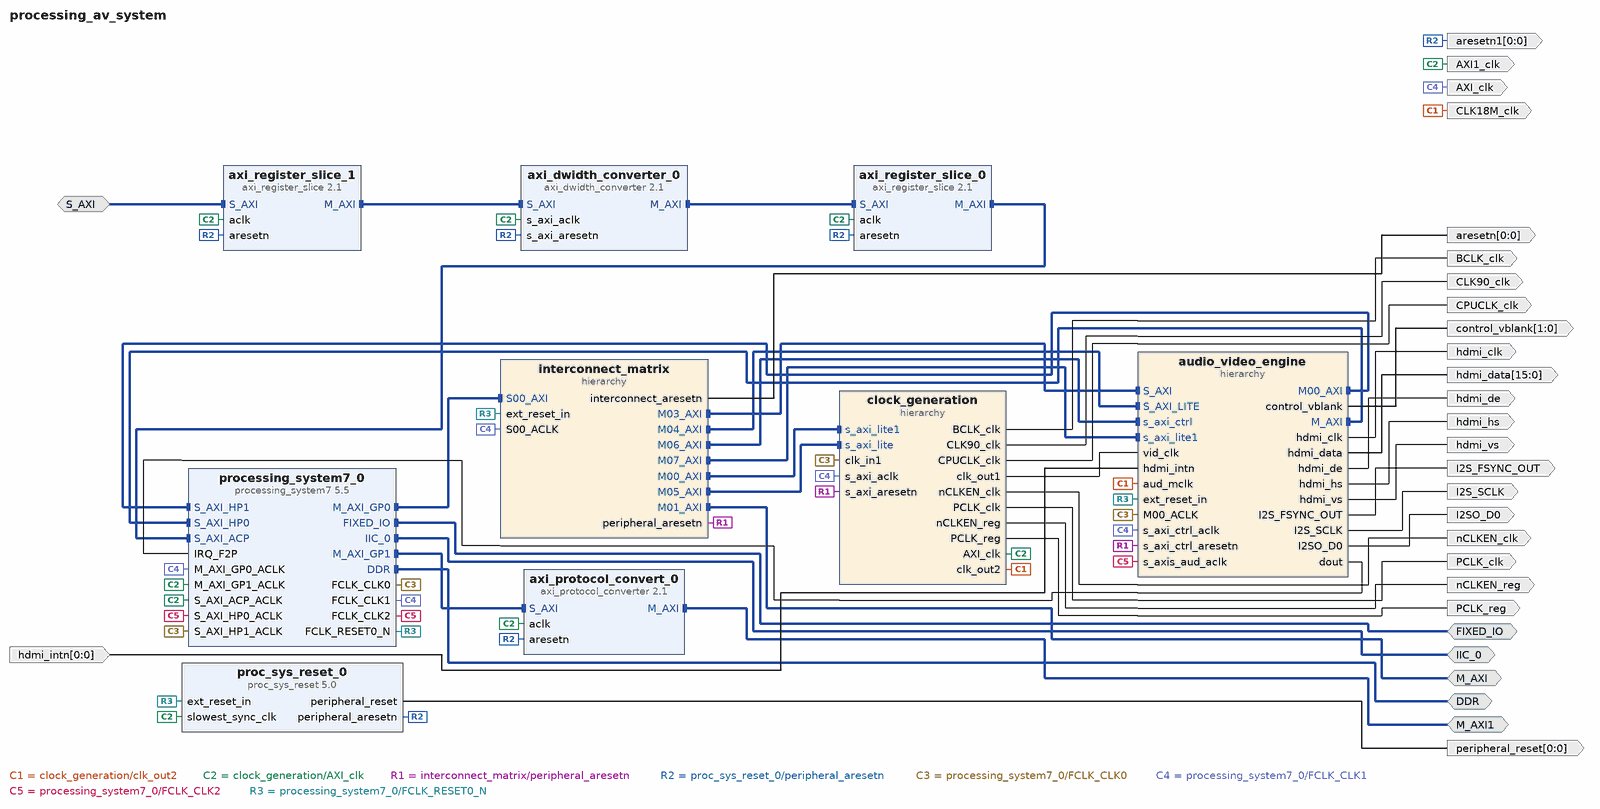
[diagram p0: block diagram of the top level]
# Vivado block design processing_av_system, xc7z020clg400-1, Vivado 2023.2
create_bd_design processing_av_system

create_bd_intf_port -mode Master -vlnv xilinx.com:interface:ddrx_rtl:1.0 DDR
create_bd_intf_port -mode Master -vlnv xilinx.com:display_processing_system7:fixedio_rtl:1.0 FIXED_IO
create_bd_intf_port -mode Master -vlnv xilinx.com:interface:iic_rtl:1.0 IIC_0
create_bd_intf_port -mode Master -vlnv xilinx.com:interface:aximm_rtl:1.0 M_AXI
set_property -dict [list \
  CONFIG.ADDR_WIDTH 31 \
  CONFIG.DATA_WIDTH 32 \
  CONFIG.HAS_BURST 0 \
  CONFIG.HAS_CACHE 0 \
  CONFIG.HAS_LOCK 0 \
  CONFIG.HAS_QOS 0 \
  CONFIG.HAS_REGION 0 \
  CONFIG.PROTOCOL AXI4LITE \
] [get_bd_intf_ports M_AXI]
create_bd_intf_port -mode Master -vlnv xilinx.com:interface:aximm_rtl:1.0 M_AXI1
set_property -dict [list \
  CONFIG.ADDR_WIDTH 32 \
  CONFIG.DATA_WIDTH 32 \
  CONFIG.FREQ_HZ 200000000 \
  CONFIG.HAS_BURST 0 \
  CONFIG.HAS_CACHE 0 \
  CONFIG.HAS_LOCK 0 \
  CONFIG.HAS_QOS 0 \
  CONFIG.HAS_REGION 0 \
  CONFIG.NUM_READ_OUTSTANDING 8 \
  CONFIG.NUM_WRITE_OUTSTANDING 8 \
  CONFIG.PROTOCOL AXI4LITE \
] [get_bd_intf_ports M_AXI1]
create_bd_intf_port -mode Slave -vlnv xilinx.com:interface:aximm_rtl:1.0 S_AXI
set_property -dict [list \
  CONFIG.ADDR_WIDTH 32 \
  CONFIG.ARUSER_WIDTH 5 \
  CONFIG.AWUSER_WIDTH 5 \
  CONFIG.BUSER_WIDTH 0 \
  CONFIG.DATA_WIDTH 32 \
  CONFIG.FREQ_HZ 200000000 \
  CONFIG.HAS_BRESP 1 \
  CONFIG.HAS_BURST 1 \
  CONFIG.HAS_CACHE 1 \
  CONFIG.HAS_LOCK 1 \
  CONFIG.HAS_PROT 1 \
  CONFIG.HAS_QOS 1 \
  CONFIG.HAS_REGION 0 \
  CONFIG.HAS_RRESP 1 \
  CONFIG.HAS_WSTRB 1 \
  CONFIG.ID_WIDTH 0 \
  CONFIG.MAX_BURST_LENGTH 16 \
  CONFIG.NUM_READ_OUTSTANDING 2 \
  CONFIG.NUM_READ_THREADS 1 \
  CONFIG.NUM_WRITE_OUTSTANDING 2 \
  CONFIG.NUM_WRITE_THREADS 1 \
  CONFIG.PROTOCOL AXI3 \
  CONFIG.READ_WRITE_MODE READ_WRITE \
  CONFIG.RUSER_BITS_PER_BYTE 0 \
  CONFIG.RUSER_WIDTH 0 \
  CONFIG.SUPPORTS_NARROW_BURST 1 \
  CONFIG.WUSER_BITS_PER_BYTE 0 \
  CONFIG.WUSER_WIDTH 0 \
] [get_bd_intf_ports S_AXI]
create_bd_port -dir O AXI1_clk
create_bd_port -dir O -type clk AXI_clk
create_bd_port -dir O -type clk BCLK_clk
set_property -dict {CONFIG.FREQ_HZ 25000000} [get_bd_ports BCLK_clk]
create_bd_port -dir O CLK18M_clk
create_bd_port -dir O -type clk CLK90_clk
set_property -dict {CONFIG.FREQ_HZ 25000000} [get_bd_ports CLK90_clk]
create_bd_port -dir O -type clk CPUCLK_clk
set_property -dict {CONFIG.FREQ_HZ 25000000} [get_bd_ports CPUCLK_clk]
create_bd_port -dir O I2SO_D0
create_bd_port -dir O I2S_FSYNC_OUT
create_bd_port -dir O I2S_SCLK
create_bd_port -dir O -type clk PCLK_clk
create_bd_port -dir O PCLK_reg
create_bd_port -dir O -from 0 -to 0 aresetn
create_bd_port -dir O -from 0 -to 0 aresetn1
create_bd_port -dir O -from 1 -to 0 control_vblank
create_bd_port -dir O -type clk hdmi_clk
set_property -dict {CONFIG.FREQ_HZ 148500000} [get_bd_ports hdmi_clk]
create_bd_port -dir O -from 15 -to 0 hdmi_data
create_bd_port -dir O hdmi_de
create_bd_port -dir O hdmi_hs
create_bd_port -dir I -from 0 -to 0 hdmi_intn
create_bd_port -dir O hdmi_vs
create_bd_port -dir O -type clk nCLKEN_clk
set_property -dict {CONFIG.FREQ_HZ 50000000} [get_bd_ports nCLKEN_clk]
create_bd_port -dir O nCLKEN_reg
create_bd_port -dir O -from 0 -to 0 -type rst peripheral_reset
set_property -dict {CONFIG.POLARITY ACTIVE_HIGH} [get_bd_ports peripheral_reset]

create_bd_cell -type hier audio_video_engine
create_bd_cell -type ip -vlnv xilinx.com:ip:axi_dwidth_converter:2.1 axi_dwidth_converter_0
create_bd_cell -type ip -vlnv xilinx.com:ip:axi_protocol_converter:2.1 axi_protocol_convert_0
create_bd_cell -type ip -vlnv xilinx.com:ip:axi_register_slice:2.1 axi_register_slice_0
create_bd_cell -type ip -vlnv xilinx.com:ip:axi_register_slice:2.1 axi_register_slice_1
create_bd_cell -type hier clock_generation
create_bd_cell -type hier interconnect_matrix
create_bd_cell -type ip -vlnv xilinx.com:ip:proc_sys_reset:5.0 proc_sys_reset_0
create_bd_cell -type ip -vlnv xilinx.com:ip:processing_system7:5.5 processing_system7_0
set_property -dict [list \
  CONFIG.PCW_APU_PERIPHERAL_FREQMHZ 666.666666 \
  CONFIG.PCW_ENET0_ENET0_IO {MIO 16 .. 27} \
  CONFIG.PCW_ENET0_GRP_MDIO_ENABLE 1 \
  CONFIG.PCW_ENET0_GRP_MDIO_IO {MIO 52 .. 53} \
  CONFIG.PCW_ENET0_PERIPHERAL_ENABLE 1 \
  CONFIG.PCW_ENET0_RESET_ENABLE 0 \
  CONFIG.PCW_ENET_RESET_ENABLE 1 \
  CONFIG.PCW_ENET_RESET_SELECT {Share reset pin} \
  CONFIG.PCW_EN_CLK1_PORT 1 \
  CONFIG.PCW_EN_CLK2_PORT 1 \
  CONFIG.PCW_EN_RST2_PORT 1 \
  CONFIG.PCW_FCLK_CLK1_BUF TRUE \
  CONFIG.PCW_FPGA0_PERIPHERAL_FREQMHZ 200 \
  CONFIG.PCW_FPGA1_PERIPHERAL_FREQMHZ 100 \
  CONFIG.PCW_FPGA2_PERIPHERAL_FREQMHZ 100 \
  CONFIG.PCW_FPGA_FCLK1_ENABLE 1 \
  CONFIG.PCW_FPGA_FCLK2_ENABLE 1 \
  CONFIG.PCW_GPIO_MIO_GPIO_ENABLE 1 \
  CONFIG.PCW_GPIO_MIO_GPIO_IO MIO \
  CONFIG.PCW_I2C0_I2C0_IO EMIO \
  CONFIG.PCW_I2C0_PERIPHERAL_ENABLE 1 \
  CONFIG.PCW_I2C_PERIPHERAL_FREQMHZ 111.111115 \
  CONFIG.PCW_I2C_RESET_ENABLE 1 \
  CONFIG.PCW_I2C_RESET_SELECT {Share reset pin} \
  CONFIG.PCW_IRQ_F2P_INTR 1 \
  CONFIG.PCW_PERIPHERAL_BOARD_PRESET None \
  CONFIG.PCW_PRESET_BANK1_VOLTAGE {LVCMOS 1.8V} \
  CONFIG.PCW_QSPI_PERIPHERAL_ENABLE 0 \
  CONFIG.PCW_SD0_GRP_CD_ENABLE 1 \
  CONFIG.PCW_SD0_GRP_CD_IO {MIO 46} \
  CONFIG.PCW_SD0_GRP_WP_ENABLE 1 \
  CONFIG.PCW_SD0_GRP_WP_IO {MIO 47} \
  CONFIG.PCW_SD0_PERIPHERAL_ENABLE 1 \
  CONFIG.PCW_SD0_SD0_IO {MIO 40 .. 45} \
  CONFIG.PCW_SDIO_PERIPHERAL_FREQMHZ 50 \
  CONFIG.PCW_S_AXI_HP0_DATA_WIDTH 32 \
  CONFIG.PCW_S_AXI_HP1_DATA_WIDTH 32 \
  CONFIG.PCW_TTC0_PERIPHERAL_ENABLE 1 \
  CONFIG.PCW_TTC0_TTC0_IO EMIO \
  CONFIG.PCW_UART1_PERIPHERAL_ENABLE 1 \
  CONFIG.PCW_UART1_UART1_IO {MIO 48 .. 49} \
  CONFIG.PCW_UART_PERIPHERAL_FREQMHZ 100 \
  CONFIG.PCW_UIPARAM_DDR_FREQ_MHZ 533.333333 \
  CONFIG.PCW_UIPARAM_DDR_PARTNO {MT41J256M16 RE-125} \
  CONFIG.PCW_USB0_PERIPHERAL_ENABLE 1 \
  CONFIG.PCW_USB0_RESET_ENABLE 1 \
  CONFIG.PCW_USB0_RESET_IO {MIO 51} \
  CONFIG.PCW_USB0_USB0_IO {MIO 28 .. 39} \
  CONFIG.PCW_USB_RESET_ENABLE 1 \
  CONFIG.PCW_USB_RESET_SELECT {Share reset pin} \
  CONFIG.PCW_USE_DEFAULT_ACP_USER_VAL 1 \
  CONFIG.PCW_USE_FABRIC_INTERRUPT 1 \
  CONFIG.PCW_USE_M_AXI_GP1 1 \
  CONFIG.PCW_USE_S_AXI_ACP 1 \
  CONFIG.PCW_USE_S_AXI_HP0 1 \
  CONFIG.PCW_USE_S_AXI_HP1 1 \
] [get_bd_cells processing_system7_0]
# 514 more settings of processing_system7_0 are not shown: defaults, MIO pin electricals, DDR timing, and values the tool derives

# ---- hierarchy /audio_video_engine ----
current_bd_instance /audio_video_engine
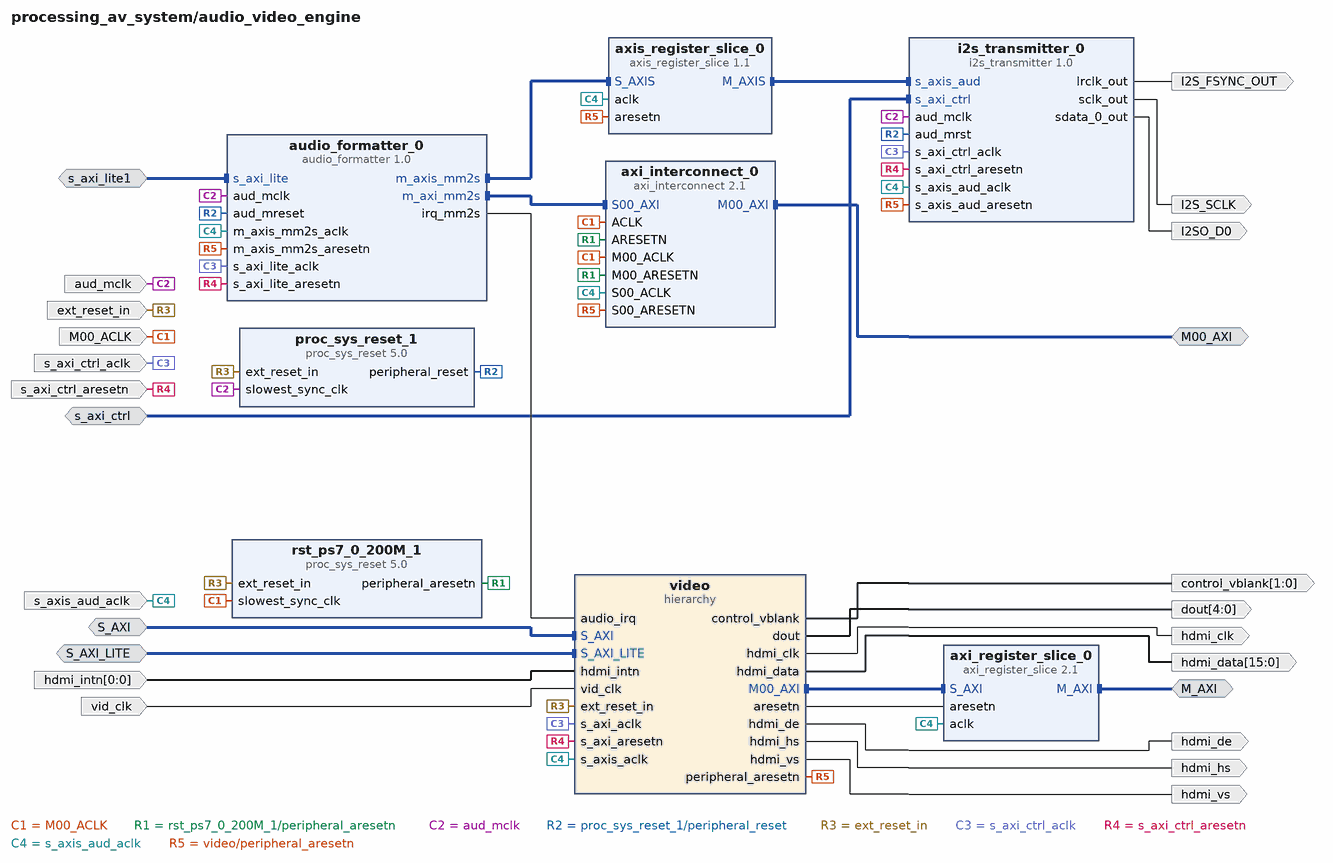
[diagram p1: block diagram inside /audio_video_engine]
create_bd_intf_pin -mode Slave -vlnv xilinx.com:interface:aximm_rtl:1.0 s_axi_ctrl
create_bd_intf_pin -mode Slave -vlnv xilinx.com:interface:aximm_rtl:1.0 s_axi_lite1
create_bd_intf_pin -mode Master -vlnv xilinx.com:interface:aximm_rtl:1.0 M_AXI
create_bd_intf_pin -mode Slave -vlnv xilinx.com:interface:aximm_rtl:1.0 S_AXI_LITE
create_bd_intf_pin -mode Slave -vlnv xilinx.com:interface:aximm_rtl:1.0 S_AXI
create_bd_intf_pin -mode Master -vlnv xilinx.com:interface:aximm_rtl:1.0 M00_AXI
create_bd_pin -dir I -type clk s_axis_aud_aclk
create_bd_pin -dir I -type clk s_axi_ctrl_aclk
create_bd_pin -dir I -type clk aud_mclk
create_bd_pin -dir I -type rst s_axi_ctrl_aresetn
create_bd_pin -dir O I2S_FSYNC_OUT
create_bd_pin -dir O I2SO_D0
create_bd_pin -dir O I2S_SCLK
create_bd_pin -dir I -type rst ext_reset_in
create_bd_pin -dir O -from 1 -to 0 control_vblank
create_bd_pin -dir O -from 4 -to 0 dout
create_bd_pin -dir I -from 0 -to 0 hdmi_intn
create_bd_pin -dir I -type clk vid_clk
create_bd_pin -dir O -type clk hdmi_clk
create_bd_pin -dir O hdmi_vs
create_bd_pin -dir O hdmi_hs
create_bd_pin -dir O -from 15 -to 0 hdmi_data
create_bd_pin -dir O hdmi_de
create_bd_pin -dir I -type clk M00_ACLK

create_bd_cell -type ip -vlnv xilinx.com:ip:proc_sys_reset:5.0 proc_sys_reset_1
create_bd_cell -type hier video
create_bd_cell -type ip -vlnv xilinx.com:ip:proc_sys_reset:5.0 rst_ps7_0_200M_1
create_bd_cell -type ip -vlnv xilinx.com:ip:audio_formatter:1.0 audio_formatter_0
set_property -dict [list \
  CONFIG.C_INCLUDE_S2MM 0 \
  CONFIG.C_MM2S_ADDR_WIDTH 32 \
  CONFIG.C_MM2S_ASYNC_CLOCK 1 \
  CONFIG.C_MM2S_DATAFORMAT 3 \
] [get_bd_cells audio_formatter_0]
create_bd_cell -type ip -vlnv xilinx.com:ip:axi_register_slice:2.1 axi_register_slice_0
create_bd_cell -type ip -vlnv xilinx.com:ip:axis_register_slice:1.1 axis_register_slice_0
create_bd_cell -type ip -vlnv xilinx.com:ip:i2s_transmitter:1.0 i2s_transmitter_0
set_property -dict {CONFIG.C_DWIDTH 16} [get_bd_cells i2s_transmitter_0]
create_bd_cell -type ip -vlnv xilinx.com:ip:axi_interconnect:2.1 axi_interconnect_0
set_property -dict {CONFIG.NUM_MI 1 CONFIG.S00_HAS_REGSLICE 4} [get_bd_cells axi_interconnect_0]

# ---- hierarchy /audio_video_engine/video ----
current_bd_instance /audio_video_engine/video
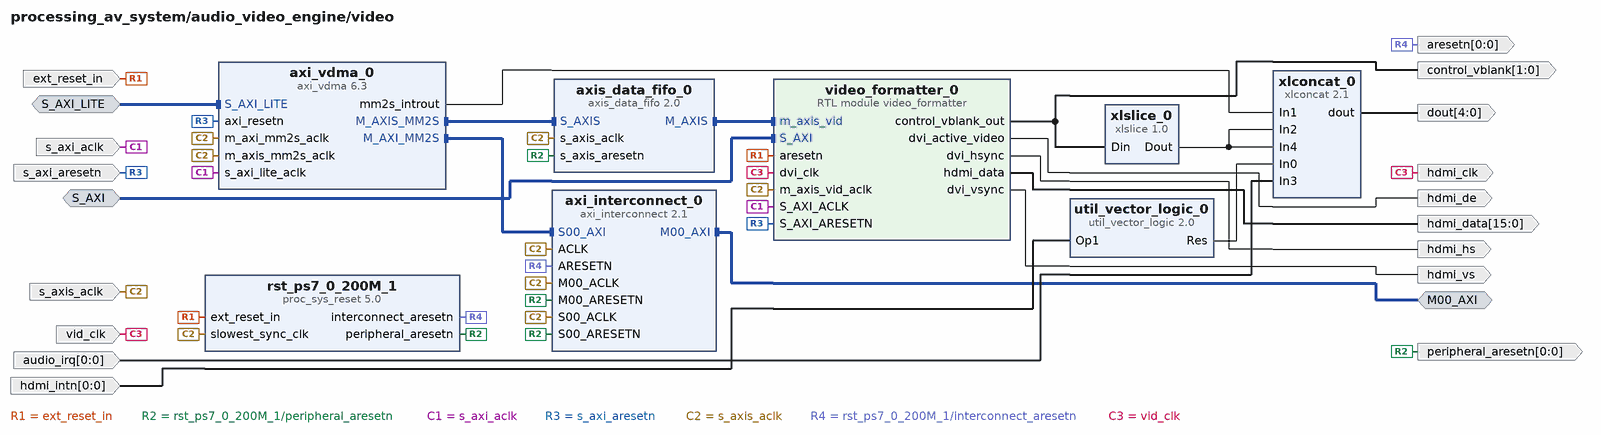
[diagram p2: block diagram inside /audio_video_engine/video]
create_bd_intf_pin -mode Slave -vlnv xilinx.com:interface:aximm_rtl:1.0 S_AXI
create_bd_intf_pin -mode Slave -vlnv xilinx.com:interface:aximm_rtl:1.0 S_AXI_LITE
create_bd_intf_pin -mode Master -vlnv xilinx.com:interface:aximm_rtl:1.0 M00_AXI
create_bd_pin -dir O hdmi_de
create_bd_pin -dir O -from 15 -to 0 hdmi_data
create_bd_pin -dir O hdmi_hs
create_bd_pin -dir O hdmi_vs
create_bd_pin -dir O -type clk hdmi_clk
create_bd_pin -dir I -type clk vid_clk
create_bd_pin -dir I -type clk s_axi_aclk
create_bd_pin -dir I -type rst s_axi_aresetn
create_bd_pin -dir I -type clk s_axis_aclk
create_bd_pin -dir I -from 0 -to 0 hdmi_intn
create_bd_pin -dir O -from 4 -to 0 dout
create_bd_pin -dir I -type rst ext_reset_in
create_bd_pin -dir O -from 1 -to 0 control_vblank
create_bd_pin -dir O -from 0 -to 0 aresetn
create_bd_pin -dir O -from 0 -to 0 -type rst peripheral_aresetn
create_bd_pin -dir I -from 0 -to 0 audio_irq

create_bd_cell -type ip -vlnv xilinx.com:ip:proc_sys_reset:5.0 rst_ps7_0_200M_1
create_bd_cell -type ip -vlnv xilinx.com:ip:axi_vdma:6.3 axi_vdma_0
set_property -dict [list \
  CONFIG.c_include_mm2s_dre 1 \
  CONFIG.c_include_s2mm 0 \
  CONFIG.c_m_axi_mm2s_data_width 32 \
  CONFIG.c_mm2s_genlock_mode 0 \
  CONFIG.c_mm2s_linebuffer_depth 512 \
  CONFIG.c_mm2s_max_burst_length 128 \
  CONFIG.c_num_fstores 1 \
] [get_bd_cells axi_vdma_0]
create_bd_cell -type ip -vlnv xilinx.com:ip:axis_data_fifo:2.0 axis_data_fifo_0
set_property -dict {CONFIG.FIFO_DEPTH 32} [get_bd_cells axis_data_fifo_0]
create_bd_cell -type ip -vlnv xilinx.com:ip:util_vector_logic:2.0 util_vector_logic_0
set_property -dict {CONFIG.C_OPERATION not CONFIG.C_SIZE 1} [get_bd_cells util_vector_logic_0]
create_bd_cell -type ip -vlnv xilinx.com:ip:xlconcat:2.1 xlconcat_0
set_property -dict {CONFIG.NUM_PORTS 5 CONFIG.dout_width 5} [get_bd_cells xlconcat_0]
create_bd_cell -type ip -vlnv xilinx.com:ip:xlslice:1.0 xlslice_0
set_property -dict {CONFIG.DIN_FROM 1 CONFIG.DIN_TO 1 CONFIG.DIN_WIDTH 2 CONFIG.DOUT_WIDTH 1} [get_bd_cells xlslice_0]
create_bd_cell -type module -reference video_formatter video_formatter_0
create_bd_cell -type ip -vlnv xilinx.com:ip:axi_interconnect:2.1 axi_interconnect_0
set_property -dict {CONFIG.NUM_MI 1 CONFIG.S00_HAS_REGSLICE 4} [get_bd_cells axi_interconnect_0]

# ---- hierarchy /clock_generation ----
current_bd_instance /clock_generation
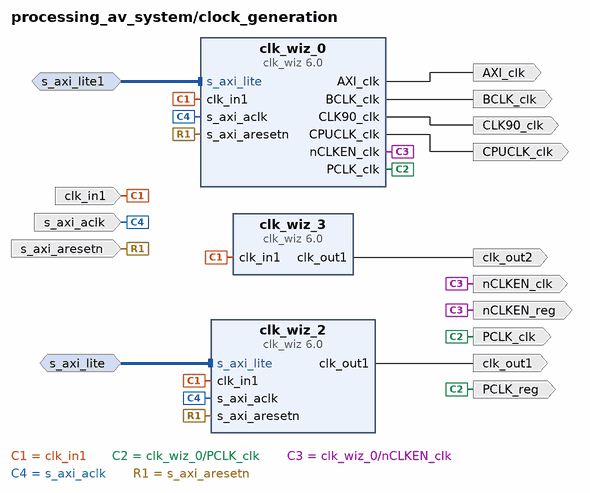
[diagram p3: block diagram inside /clock_generation]
create_bd_intf_pin -mode Slave -vlnv xilinx.com:interface:aximm_rtl:1.0 s_axi_lite
create_bd_intf_pin -mode Slave -vlnv xilinx.com:interface:aximm_rtl:1.0 s_axi_lite1
create_bd_pin -dir I -type clk clk_in1
create_bd_pin -dir I -type clk s_axi_aclk
create_bd_pin -dir I -type rst s_axi_aresetn
create_bd_pin -dir O -type clk clk_out1
create_bd_pin -dir O -type clk AXI_clk
create_bd_pin -dir O -type clk nCLKEN_clk
create_bd_pin -dir O -type clk PCLK_clk
create_bd_pin -dir O -type clk CPUCLK_clk
create_bd_pin -dir O -type clk CLK90_clk
create_bd_pin -dir O -type clk BCLK_clk
create_bd_pin -dir O -type clk clk_out2
create_bd_pin -dir O PCLK_reg
create_bd_pin -dir O nCLKEN_reg

create_bd_cell -type ip -vlnv xilinx.com:ip:clk_wiz:6.0 clk_wiz_0
set_property -dict [list \
  CONFIG.CLKIN1_JITTER_PS 50.0 \
  CONFIG.CLKOUT1_DRIVES BUFGCE \
  CONFIG.CLKOUT1_JITTER 96.634 \
  CONFIG.CLKOUT1_MATCHED_ROUTING true \
  CONFIG.CLKOUT1_PHASE_ERROR 91.235 \
  CONFIG.CLKOUT1_REQUESTED_OUT_FREQ 200 \
  CONFIG.CLKOUT2_DRIVES BUFGCE \
  CONFIG.CLKOUT2_JITTER 110.629 \
  CONFIG.CLKOUT2_MATCHED_ROUTING true \
  CONFIG.CLKOUT2_PHASE_ERROR 91.235 \
  CONFIG.CLKOUT2_REQUESTED_OUT_FREQ 100 \
  CONFIG.CLKOUT2_REQUESTED_PHASE 30.000 \
  CONFIG.CLKOUT2_USED true \
  CONFIG.CLKOUT3_DRIVES BUFGCE \
  CONFIG.CLKOUT3_JITTER 127.364 \
  CONFIG.CLKOUT3_MATCHED_ROUTING true \
  CONFIG.CLKOUT3_PHASE_ERROR 91.235 \
  CONFIG.CLKOUT3_REQUESTED_DUTY_CYCLE 50.000 \
  CONFIG.CLKOUT3_REQUESTED_OUT_FREQ 50 \
  CONFIG.CLKOUT3_REQUESTED_PHASE 60.000 \
  CONFIG.CLKOUT3_USED true \
  CONFIG.CLKOUT4_DRIVES BUFGCE \
  CONFIG.CLKOUT4_JITTER 146.624 \
  CONFIG.CLKOUT4_MATCHED_ROUTING true \
  CONFIG.CLKOUT4_PHASE_ERROR 91.235 \
  CONFIG.CLKOUT4_REQUESTED_OUT_FREQ 25 \
  CONFIG.CLKOUT4_REQUESTED_PHASE 40.000 \
  CONFIG.CLKOUT4_USED true \
  CONFIG.CLKOUT5_DRIVES BUFGCE \
  CONFIG.CLKOUT5_JITTER 146.624 \
  CONFIG.CLKOUT5_MATCHED_ROUTING true \
  CONFIG.CLKOUT5_PHASE_ERROR 91.235 \
  CONFIG.CLKOUT5_REQUESTED_DUTY_CYCLE 50.000 \
  CONFIG.CLKOUT5_REQUESTED_OUT_FREQ 25 \
  CONFIG.CLKOUT5_REQUESTED_PHASE 270.000 \
  CONFIG.CLKOUT5_USED true \
  CONFIG.CLKOUT6_DRIVES BUFGCE \
  CONFIG.CLKOUT6_JITTER 146.624 \
  CONFIG.CLKOUT6_MATCHED_ROUTING true \
  CONFIG.CLKOUT6_PHASE_ERROR 91.235 \
  CONFIG.CLKOUT6_REQUESTED_DUTY_CYCLE 50.000 \
  CONFIG.CLKOUT6_REQUESTED_OUT_FREQ 25 \
  CONFIG.CLKOUT6_REQUESTED_PHASE 180.000 \
  CONFIG.CLKOUT6_USED true \
  CONFIG.CLKOUT7_DRIVES BUFGCE \
  CONFIG.CLKOUT7_JITTER 98.146 \
  CONFIG.CLKOUT7_PHASE_ERROR 89.971 \
  CONFIG.CLKOUT7_REQUESTED_OUT_FREQ 100.000 \
  CONFIG.CLKOUT7_USED false \
  CONFIG.CLK_OUT1_PORT AXI_clk \
  CONFIG.CLK_OUT2_PORT PCLK_clk \
  CONFIG.CLK_OUT3_PORT nCLKEN_clk \
  CONFIG.CLK_OUT4_PORT BCLK_clk \
  CONFIG.CLK_OUT5_PORT CLK90_clk \
  CONFIG.CLK_OUT6_PORT CPUCLK_clk \
  CONFIG.ENABLE_CLOCK_MONITOR false \
  CONFIG.FEEDBACK_SOURCE FDBK_AUTO \
  CONFIG.JITTER_SEL No_Jitter \
  CONFIG.MMCM_BANDWIDTH OPTIMIZED \
  CONFIG.MMCM_CLKFBOUT_MULT_F 6 \
  CONFIG.MMCM_CLKIN1_PERIOD 5.000 \
  CONFIG.MMCM_CLKIN2_PERIOD 10.0 \
  CONFIG.MMCM_CLKOUT0_DIVIDE_F 6 \
  CONFIG.MMCM_CLKOUT1_DIVIDE 12 \
  CONFIG.MMCM_CLKOUT1_PHASE 30.000 \
  CONFIG.MMCM_CLKOUT2_DIVIDE 24 \
  CONFIG.MMCM_CLKOUT2_DUTY_CYCLE 0.500 \
  CONFIG.MMCM_CLKOUT2_PHASE 60.000 \
  CONFIG.MMCM_CLKOUT3_DIVIDE 48 \
  CONFIG.MMCM_CLKOUT3_PHASE 40.3125 \
  CONFIG.MMCM_CLKOUT4_DIVIDE 48 \
  CONFIG.MMCM_CLKOUT4_DUTY_CYCLE 0.500 \
  CONFIG.MMCM_CLKOUT4_PHASE 310.3125 \
  CONFIG.MMCM_CLKOUT5_DIVIDE 48 \
  CONFIG.MMCM_CLKOUT5_DUTY_CYCLE 0.500 \
  CONFIG.MMCM_CLKOUT5_PHASE 220.3125 \
  CONFIG.MMCM_CLKOUT6_DIVIDE 1 \
  CONFIG.MMCM_COMPENSATION ZHOLD \
  CONFIG.MMCM_DIVCLK_DIVIDE 1 \
  CONFIG.NUM_OUT_CLKS 6 \
  CONFIG.OVERRIDE_MMCM true \
  CONFIG.PHASE_DUTY_CONFIG true \
  CONFIG.PRIMITIVE MMCM \
  CONFIG.PRIM_SOURCE Global_buffer \
  CONFIG.USE_DYN_PHASE_SHIFT false \
  CONFIG.USE_DYN_RECONFIG true \
  CONFIG.USE_SAFE_CLOCK_STARTUP true \
] [get_bd_cells clk_wiz_0]
create_bd_cell -type ip -vlnv xilinx.com:ip:clk_wiz:6.0 clk_wiz_2
set_property -dict [list \
  CONFIG.AXI_DRP false \
  CONFIG.CLKIN1_JITTER_PS 50.0 \
  CONFIG.CLKOUT1_JITTER 215.720 \
  CONFIG.CLKOUT1_PHASE_ERROR 245.344 \
  CONFIG.CLKOUT1_REQUESTED_OUT_FREQ 148.5 \
  CONFIG.CLKOUT2_JITTER 366.891 \
  CONFIG.CLKOUT2_PHASE_ERROR 479.985 \
  CONFIG.CLKOUT2_REQUESTED_OUT_FREQ 100.000 \
  CONFIG.CLKOUT2_REQUESTED_PHASE 0.000 \
  CONFIG.CLKOUT2_USED false \
  CONFIG.FEEDBACK_SOURCE FDBK_AUTO \
  CONFIG.MMCM_CLKFBOUT_MULT_F 37.125 \
  CONFIG.MMCM_CLKIN1_PERIOD 5.000 \
  CONFIG.MMCM_CLKIN2_PERIOD 10.0 \
  CONFIG.MMCM_CLKOUT0_DIVIDE_F 6.250 \
  CONFIG.MMCM_CLKOUT1_DIVIDE 1 \
  CONFIG.MMCM_COMPENSATION ZHOLD \
  CONFIG.MMCM_DIVCLK_DIVIDE 8 \
  CONFIG.NUM_OUT_CLKS 1 \
  CONFIG.PHASE_DUTY_CONFIG false \
  CONFIG.USE_DYN_RECONFIG true \
  CONFIG.USE_LOCKED true \
  CONFIG.USE_RESET true \
] [get_bd_cells clk_wiz_2]
create_bd_cell -type ip -vlnv xilinx.com:ip:clk_wiz:6.0 clk_wiz_3
set_property -dict [list \
  CONFIG.CLKIN1_JITTER_PS 50.0 \
  CONFIG.CLKOUT1_DRIVES BUFG \
  CONFIG.CLKOUT1_JITTER 148.147 \
  CONFIG.CLKOUT1_PHASE_ERROR 81.823 \
  CONFIG.CLKOUT1_REQUESTED_OUT_FREQ 18.432000 \
  CONFIG.CLKOUT2_DRIVES BUFG \
  CONFIG.CLKOUT3_DRIVES BUFG \
  CONFIG.CLKOUT4_DRIVES BUFG \
  CONFIG.CLKOUT5_DRIVES BUFG \
  CONFIG.CLKOUT6_DRIVES BUFG \
  CONFIG.CLKOUT7_DRIVES BUFG \
  CONFIG.FEEDBACK_SOURCE FDBK_AUTO \
  CONFIG.JITTER_SEL Min_O_Jitter \
  CONFIG.MMCM_BANDWIDTH HIGH \
  CONFIG.MMCM_CLKFBOUT_MULT_F 5.875 \
  CONFIG.MMCM_CLKIN1_PERIOD 5.000 \
  CONFIG.MMCM_CLKIN2_PERIOD 10.0 \
  CONFIG.MMCM_CLKOUT0_DIVIDE_F 63.750 \
  CONFIG.MMCM_COMPENSATION ZHOLD \
  CONFIG.MMCM_DIVCLK_DIVIDE 1 \
  CONFIG.PRIMITIVE MMCM \
  CONFIG.SECONDARY_SOURCE Single_ended_clock_capable_pin \
  CONFIG.USE_LOCKED false \
  CONFIG.USE_PHASE_ALIGNMENT true \
  CONFIG.USE_RESET false \
] [get_bd_cells clk_wiz_3]

# ---- hierarchy /interconnect_matrix ----
current_bd_instance /interconnect_matrix
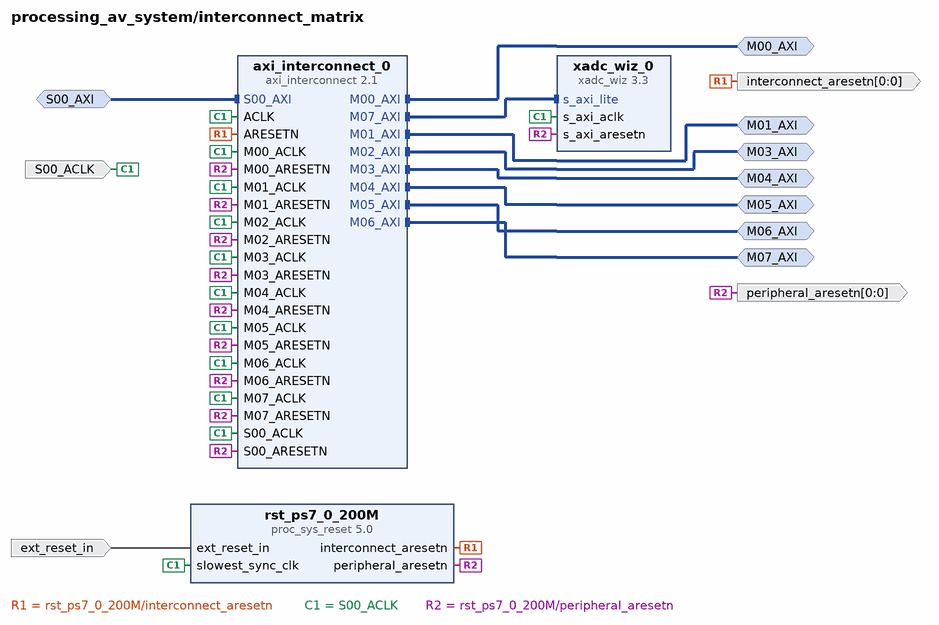
[diagram p4: block diagram inside /interconnect_matrix]
create_bd_intf_pin -mode Master -vlnv xilinx.com:interface:aximm_rtl:1.0 M06_AXI
create_bd_intf_pin -mode Slave -vlnv xilinx.com:interface:aximm_rtl:1.0 S00_AXI
create_bd_intf_pin -mode Master -vlnv xilinx.com:interface:aximm_rtl:1.0 M01_AXI
create_bd_intf_pin -mode Master -vlnv xilinx.com:interface:aximm_rtl:1.0 M04_AXI
create_bd_intf_pin -mode Master -vlnv xilinx.com:interface:aximm_rtl:1.0 M03_AXI
create_bd_intf_pin -mode Master -vlnv xilinx.com:interface:aximm_rtl:1.0 M07_AXI
create_bd_intf_pin -mode Master -vlnv xilinx.com:interface:aximm_rtl:1.0 M05_AXI
create_bd_intf_pin -mode Master -vlnv xilinx.com:interface:aximm_rtl:1.0 M00_AXI
create_bd_pin -dir I -type clk S00_ACLK
create_bd_pin -dir I -type rst ext_reset_in
create_bd_pin -dir O -from 0 -to 0 -type rst peripheral_aresetn
create_bd_pin -dir O -from 0 -to 0 interconnect_aresetn

create_bd_cell -type ip -vlnv xilinx.com:ip:proc_sys_reset:5.0 rst_ps7_0_200M
create_bd_cell -type ip -vlnv xilinx.com:ip:axi_interconnect:2.1 axi_interconnect_0
set_property -dict [list \
  CONFIG.ENABLE_ADVANCED_OPTIONS 1 \
  CONFIG.M00_HAS_REGSLICE 3 \
  CONFIG.M01_HAS_REGSLICE 3 \
  CONFIG.M02_HAS_REGSLICE 3 \
  CONFIG.M03_HAS_REGSLICE 3 \
  CONFIG.M04_HAS_REGSLICE 3 \
  CONFIG.NUM_MI 8 \
  CONFIG.S00_HAS_REGSLICE 4 \
  CONFIG.STRATEGY 1 \
] [get_bd_cells axi_interconnect_0]
create_bd_cell -type ip -vlnv xilinx.com:ip:xadc_wiz:3.3 xadc_wiz_0
set_property -dict [list \
  CONFIG.AVERAGE_ENABLE_TEMPERATURE true \
  CONFIG.AVERAGE_ENABLE_VBRAM true \
  CONFIG.AVERAGE_ENABLE_VCCAUX true \
  CONFIG.AVERAGE_ENABLE_VCCDDRO true \
  CONFIG.AVERAGE_ENABLE_VCCINT true \
  CONFIG.AVERAGE_ENABLE_VCCPAUX true \
  CONFIG.AVERAGE_ENABLE_VCCPINT true \
  CONFIG.CHANNEL_ENABLE_TEMPERATURE true \
  CONFIG.CHANNEL_ENABLE_VBRAM true \
  CONFIG.CHANNEL_ENABLE_VCCAUX true \
  CONFIG.CHANNEL_ENABLE_VCCDDRO true \
  CONFIG.CHANNEL_ENABLE_VCCINT true \
  CONFIG.CHANNEL_ENABLE_VCCPAUX true \
  CONFIG.CHANNEL_ENABLE_VCCPINT true \
  CONFIG.CHANNEL_ENABLE_VP_VN false \
  CONFIG.ENABLE_RESET false \
  CONFIG.ENABLE_VCCDDRO_ALARM false \
  CONFIG.ENABLE_VCCPAUX_ALARM false \
  CONFIG.ENABLE_VCCPINT_ALARM false \
  CONFIG.INTERFACE_SELECTION Enable_AXI \
  CONFIG.SEQUENCER_MODE Off \
  CONFIG.TEMPERATURE_ALARM_OT_TRIGGER 80 \
  CONFIG.USER_TEMP_ALARM false \
  CONFIG.VCCAUX_ALARM false \
  CONFIG.VCCINT_ALARM false \
  CONFIG.XADC_STARUP_SELECTION simultaneous_sampling \
] [get_bd_cells xadc_wiz_0]

# ---- connections ----

current_bd_instance /audio_video_engine
connect_bd_intf_net [get_bd_intf_pins s_axi_ctrl] [get_bd_intf_pins i2s_transmitter_0/s_axi_ctrl]
connect_bd_intf_net [get_bd_intf_pins M_AXI] [get_bd_intf_pins axi_register_slice_0/M_AXI]
connect_bd_intf_net [get_bd_intf_pins S_AXI] [get_bd_intf_pins video/S_AXI]
connect_bd_intf_net [get_bd_intf_pins S_AXI_LITE] [get_bd_intf_pins video/S_AXI_LITE]
connect_bd_intf_net [get_bd_intf_pins s_axi_lite1] [get_bd_intf_pins audio_formatter_0/s_axi_lite]
connect_bd_intf_net [get_bd_intf_pins audio_formatter_0/m_axi_mm2s] [get_bd_intf_pins axi_interconnect_0/S00_AXI]
connect_bd_intf_net [get_bd_intf_pins audio_formatter_0/m_axis_mm2s] [get_bd_intf_pins axis_register_slice_0/S_AXIS]
connect_bd_intf_net [get_bd_intf_pins M00_AXI] [get_bd_intf_pins axi_interconnect_0/M00_AXI]
connect_bd_intf_net [get_bd_intf_pins axis_register_slice_0/M_AXIS] [get_bd_intf_pins i2s_transmitter_0/s_axis_aud]
connect_bd_intf_net [get_bd_intf_pins axi_register_slice_0/S_AXI] [get_bd_intf_pins video/M00_AXI]
connect_bd_net [get_bd_pins M00_ACLK] \
  [get_bd_pins rst_ps7_0_200M_1/slowest_sync_clk] [get_bd_pins axi_interconnect_0/ACLK] \
  [get_bd_pins axi_interconnect_0/M00_ACLK]
connect_bd_net -net M00_ARESETN_1 [get_bd_pins rst_ps7_0_200M_1/peripheral_aresetn] \
  [get_bd_pins axi_interconnect_0/ARESETN] [get_bd_pins axi_interconnect_0/M00_ARESETN]
connect_bd_net [get_bd_pins aud_mclk] \
  [get_bd_pins audio_formatter_0/aud_mclk] [get_bd_pins i2s_transmitter_0/aud_mclk] \
  [get_bd_pins proc_sys_reset_1/slowest_sync_clk]
connect_bd_net -net aud_mrst_1 [get_bd_pins proc_sys_reset_1/peripheral_reset] \
  [get_bd_pins audio_formatter_0/aud_mreset] [get_bd_pins i2s_transmitter_0/aud_mrst]
connect_bd_net -net audio_irq_1 [get_bd_pins audio_formatter_0/irq_mm2s] [get_bd_pins video/audio_irq]
connect_bd_net [get_bd_pins ext_reset_in] \
  [get_bd_pins video/ext_reset_in] [get_bd_pins proc_sys_reset_1/ext_reset_in] [get_bd_pins rst_ps7_0_200M_1/ext_reset_in]
connect_bd_net [get_bd_pins hdmi_intn] [get_bd_pins video/hdmi_intn]
connect_bd_net [get_bd_pins i2s_transmitter_0/lrclk_out] [get_bd_pins I2S_FSYNC_OUT]
connect_bd_net [get_bd_pins i2s_transmitter_0/sclk_out] [get_bd_pins I2S_SCLK]
connect_bd_net [get_bd_pins i2s_transmitter_0/sdata_0_out] [get_bd_pins I2SO_D0]
connect_bd_net [get_bd_pins s_axi_ctrl_aclk] \
  [get_bd_pins video/s_axi_aclk] [get_bd_pins audio_formatter_0/s_axi_lite_aclk] \
  [get_bd_pins i2s_transmitter_0/s_axi_ctrl_aclk]
connect_bd_net [get_bd_pins s_axi_ctrl_aresetn] \
  [get_bd_pins video/s_axi_aresetn] [get_bd_pins audio_formatter_0/s_axi_lite_aresetn] \
  [get_bd_pins i2s_transmitter_0/s_axi_ctrl_aresetn]
connect_bd_net [get_bd_pins s_axis_aud_aclk] \
  [get_bd_pins video/s_axis_aclk] [get_bd_pins audio_formatter_0/m_axis_mm2s_aclk] [get_bd_pins axi_register_slice_0/aclk] \
  [get_bd_pins axis_register_slice_0/aclk] [get_bd_pins i2s_transmitter_0/s_axis_aud_aclk] \
  [get_bd_pins axi_interconnect_0/S00_ACLK]
connect_bd_net [get_bd_pins vid_clk] [get_bd_pins video/vid_clk]
connect_bd_net [get_bd_pins video/aresetn] [get_bd_pins axi_register_slice_0/aresetn]
connect_bd_net [get_bd_pins video/control_vblank] [get_bd_pins control_vblank]
connect_bd_net [get_bd_pins video/dout] [get_bd_pins dout]
connect_bd_net [get_bd_pins video/hdmi_clk] [get_bd_pins hdmi_clk]
connect_bd_net [get_bd_pins video/hdmi_data] [get_bd_pins hdmi_data]
connect_bd_net [get_bd_pins video/hdmi_de] [get_bd_pins hdmi_de]
connect_bd_net [get_bd_pins video/hdmi_hs] [get_bd_pins hdmi_hs]
connect_bd_net [get_bd_pins video/hdmi_vs] [get_bd_pins hdmi_vs]
connect_bd_net [get_bd_pins video/peripheral_aresetn] \
  [get_bd_pins audio_formatter_0/m_axis_mm2s_aresetn] [get_bd_pins axis_register_slice_0/aresetn] \
  [get_bd_pins i2s_transmitter_0/s_axis_aud_aresetn] [get_bd_pins axi_interconnect_0/S00_ARESETN]

current_bd_instance /audio_video_engine/video
connect_bd_intf_net [get_bd_intf_pins S_AXI_LITE] [get_bd_intf_pins axi_vdma_0/S_AXI_LITE]
connect_bd_intf_net [get_bd_intf_pins M00_AXI] [get_bd_intf_pins axi_interconnect_0/M00_AXI]
connect_bd_intf_net [get_bd_intf_pins axi_vdma_0/M_AXIS_MM2S] [get_bd_intf_pins axis_data_fifo_0/S_AXIS]
connect_bd_intf_net [get_bd_intf_pins axi_vdma_0/M_AXI_MM2S] [get_bd_intf_pins axi_interconnect_0/S00_AXI]
connect_bd_intf_net [get_bd_intf_pins axis_data_fifo_0/M_AXIS] [get_bd_intf_pins video_formatter_0/m_axis_vid]
connect_bd_intf_net -intf_net ctrl_1 [get_bd_intf_pins S_AXI] [get_bd_intf_pins video_formatter_0/S_AXI]
connect_bd_net -net In3_1 [get_bd_pins audio_irq] [get_bd_pins xlconcat_0/In3]
connect_bd_net [get_bd_pins axi_vdma_0/mm2s_introut] [get_bd_pins xlconcat_0/In1]
connect_bd_net -net ext_reset_in_0_1 [get_bd_pins ext_reset_in] [get_bd_pins video_formatter_0/aresetn] [get_bd_pins rst_ps7_0_200M_1/ext_reset_in]
connect_bd_net [get_bd_pins hdmi_intn] [get_bd_pins util_vector_logic_0/Op1]
connect_bd_net [get_bd_pins rst_ps7_0_200M_1/peripheral_aresetn] \
  [get_bd_pins peripheral_aresetn] [get_bd_pins axis_data_fifo_0/s_axis_aresetn] [get_bd_pins axi_interconnect_0/S00_ARESETN] \
  [get_bd_pins axi_interconnect_0/M00_ARESETN]
connect_bd_net -net s_axi_aclk_0_1 [get_bd_pins s_axi_aclk] [get_bd_pins video_formatter_0/S_AXI_ACLK] [get_bd_pins axi_vdma_0/s_axi_lite_aclk]
connect_bd_net -net s_axi_aresetn_0_1 [get_bd_pins s_axi_aresetn] [get_bd_pins video_formatter_0/S_AXI_ARESETN] [get_bd_pins axi_vdma_0/axi_resetn]
connect_bd_net [get_bd_pins s_axis_aclk] \
  [get_bd_pins video_formatter_0/m_axis_vid_aclk] [get_bd_pins axi_vdma_0/m_axi_mm2s_aclk] \
  [get_bd_pins axi_vdma_0/m_axis_mm2s_aclk] [get_bd_pins axis_data_fifo_0/s_axis_aclk] \
  [get_bd_pins rst_ps7_0_200M_1/slowest_sync_clk] [get_bd_pins axi_interconnect_0/ACLK] \
  [get_bd_pins axi_interconnect_0/S00_ACLK] [get_bd_pins axi_interconnect_0/M00_ACLK]
connect_bd_net -net s_axis_aresetn_1 [get_bd_pins rst_ps7_0_200M_1/interconnect_aresetn] \
  [get_bd_pins aresetn] [get_bd_pins axi_interconnect_0/ARESETN]
connect_bd_net [get_bd_pins util_vector_logic_0/Res] [get_bd_pins xlconcat_0/In0]
connect_bd_net [get_bd_pins vid_clk] [get_bd_pins hdmi_clk] [get_bd_pins video_formatter_0/dvi_clk]
connect_bd_net -net video_formatter_0_control_vblank [get_bd_pins video_formatter_0/control_vblank_out] \
  [get_bd_pins control_vblank] [get_bd_pins xlslice_0/Din]
connect_bd_net [get_bd_pins video_formatter_0/dvi_active_video] [get_bd_pins hdmi_de]
connect_bd_net [get_bd_pins video_formatter_0/dvi_hsync] [get_bd_pins hdmi_hs]
connect_bd_net [get_bd_pins video_formatter_0/dvi_vsync] [get_bd_pins hdmi_vs]
connect_bd_net [get_bd_pins video_formatter_0/hdmi_data] [get_bd_pins hdmi_data]
connect_bd_net [get_bd_pins xlconcat_0/dout] [get_bd_pins dout]
connect_bd_net [get_bd_pins xlslice_0/Dout] [get_bd_pins xlconcat_0/In2] [get_bd_pins xlconcat_0/In4]

current_bd_instance /clock_generation
connect_bd_intf_net [get_bd_intf_pins s_axi_lite] [get_bd_intf_pins clk_wiz_2/s_axi_lite]
connect_bd_intf_net [get_bd_intf_pins s_axi_lite1] [get_bd_intf_pins clk_wiz_0/s_axi_lite]
connect_bd_net -net clk_in1_1 [get_bd_pins clk_in1] [get_bd_pins clk_wiz_0/clk_in1] [get_bd_pins clk_wiz_2/clk_in1] [get_bd_pins clk_wiz_3/clk_in1]
connect_bd_net [get_bd_pins clk_wiz_0/AXI_clk] [get_bd_pins AXI_clk]
connect_bd_net [get_bd_pins clk_wiz_0/BCLK_clk] [get_bd_pins BCLK_clk]
connect_bd_net [get_bd_pins clk_wiz_0/CLK90_clk] [get_bd_pins CLK90_clk]
connect_bd_net [get_bd_pins clk_wiz_0/CPUCLK_clk] [get_bd_pins CPUCLK_clk]
connect_bd_net [get_bd_pins clk_wiz_0/PCLK_clk] [get_bd_pins PCLK_clk] [get_bd_pins PCLK_reg]
connect_bd_net [get_bd_pins clk_wiz_0/nCLKEN_clk] [get_bd_pins nCLKEN_clk] [get_bd_pins nCLKEN_reg]
connect_bd_net [get_bd_pins clk_wiz_2/clk_out1] [get_bd_pins clk_out1]
connect_bd_net [get_bd_pins clk_wiz_3/clk_out1] [get_bd_pins clk_out2]
connect_bd_net [get_bd_pins s_axi_aclk] [get_bd_pins clk_wiz_0/s_axi_aclk] [get_bd_pins clk_wiz_2/s_axi_aclk]
connect_bd_net [get_bd_pins s_axi_aresetn] [get_bd_pins clk_wiz_0/s_axi_aresetn] [get_bd_pins clk_wiz_2/s_axi_aresetn]

current_bd_instance /interconnect_matrix
connect_bd_intf_net [get_bd_intf_pins S00_AXI] [get_bd_intf_pins axi_interconnect_0/S00_AXI]
connect_bd_intf_net [get_bd_intf_pins M01_AXI] [get_bd_intf_pins axi_interconnect_0/M01_AXI]
connect_bd_intf_net [get_bd_intf_pins M00_AXI] [get_bd_intf_pins axi_interconnect_0/M00_AXI]
connect_bd_intf_net [get_bd_intf_pins M03_AXI] [get_bd_intf_pins axi_interconnect_0/M02_AXI]
connect_bd_intf_net [get_bd_intf_pins M04_AXI] [get_bd_intf_pins axi_interconnect_0/M03_AXI]
connect_bd_intf_net [get_bd_intf_pins M05_AXI] [get_bd_intf_pins axi_interconnect_0/M04_AXI]
connect_bd_intf_net [get_bd_intf_pins M06_AXI] [get_bd_intf_pins axi_interconnect_0/M05_AXI]
connect_bd_intf_net [get_bd_intf_pins M07_AXI] [get_bd_intf_pins axi_interconnect_0/M06_AXI]
connect_bd_intf_net [get_bd_intf_pins axi_interconnect_0/M07_AXI] [get_bd_intf_pins xadc_wiz_0/s_axi_lite]
connect_bd_net -net ARESETN_1 [get_bd_pins rst_ps7_0_200M/interconnect_aresetn] \
  [get_bd_pins interconnect_aresetn] [get_bd_pins axi_interconnect_0/ARESETN]
connect_bd_net [get_bd_pins S00_ACLK] \
  [get_bd_pins axi_interconnect_0/ACLK] [get_bd_pins axi_interconnect_0/S00_ACLK] [get_bd_pins axi_interconnect_0/M00_ACLK] \
  [get_bd_pins axi_interconnect_0/M01_ACLK] [get_bd_pins axi_interconnect_0/M02_ACLK] \
  [get_bd_pins axi_interconnect_0/M03_ACLK] [get_bd_pins axi_interconnect_0/M04_ACLK] \
  [get_bd_pins axi_interconnect_0/M05_ACLK] [get_bd_pins axi_interconnect_0/M06_ACLK] \
  [get_bd_pins axi_interconnect_0/M07_ACLK] [get_bd_pins rst_ps7_0_200M/slowest_sync_clk] [get_bd_pins xadc_wiz_0/s_axi_aclk]
connect_bd_net [get_bd_pins ext_reset_in] [get_bd_pins rst_ps7_0_200M/ext_reset_in]
connect_bd_net [get_bd_pins rst_ps7_0_200M/peripheral_aresetn] \
  [get_bd_pins peripheral_aresetn] [get_bd_pins axi_interconnect_0/S00_ARESETN] [get_bd_pins axi_interconnect_0/M00_ARESETN] \
  [get_bd_pins axi_interconnect_0/M01_ARESETN] [get_bd_pins axi_interconnect_0/M02_ARESETN] \
  [get_bd_pins axi_interconnect_0/M03_ARESETN] [get_bd_pins axi_interconnect_0/M04_ARESETN] \
  [get_bd_pins axi_interconnect_0/M05_ARESETN] [get_bd_pins axi_interconnect_0/M06_ARESETN] \
  [get_bd_pins axi_interconnect_0/M07_ARESETN] [get_bd_pins xadc_wiz_0/s_axi_aresetn]

current_bd_instance /
connect_bd_intf_net [get_bd_intf_ports FIXED_IO] [get_bd_intf_pins processing_system7_0/FIXED_IO]
connect_bd_intf_net [get_bd_intf_ports IIC_0] [get_bd_intf_pins processing_system7_0/IIC_0]
connect_bd_intf_net [get_bd_intf_ports DDR] [get_bd_intf_pins processing_system7_0/DDR]
connect_bd_intf_net [get_bd_intf_pins audio_video_engine/S_AXI] [get_bd_intf_pins interconnect_matrix/M03_AXI]
connect_bd_intf_net [get_bd_intf_ports S_AXI] [get_bd_intf_pins axi_register_slice_1/S_AXI]
connect_bd_intf_net [get_bd_intf_pins audio_video_engine/S_AXI_LITE] [get_bd_intf_pins interconnect_matrix/M04_AXI]
connect_bd_intf_net [get_bd_intf_pins processing_system7_0/S_AXI_HP1] [get_bd_intf_pins audio_video_engine/M00_AXI]
connect_bd_intf_net [get_bd_intf_pins processing_system7_0/S_AXI_HP0] [get_bd_intf_pins audio_video_engine/M_AXI]
connect_bd_intf_net [get_bd_intf_pins axi_dwidth_converter_0/M_AXI] [get_bd_intf_pins axi_register_slice_0/S_AXI]
connect_bd_intf_net [get_bd_intf_ports M_AXI1] [get_bd_intf_pins axi_protocol_convert_0/M_AXI]
connect_bd_intf_net [get_bd_intf_pins axi_register_slice_0/M_AXI] [get_bd_intf_pins processing_system7_0/S_AXI_ACP]
connect_bd_intf_net [get_bd_intf_pins axi_register_slice_1/M_AXI] [get_bd_intf_pins axi_dwidth_converter_0/S_AXI]
connect_bd_intf_net [get_bd_intf_ports M_AXI] [get_bd_intf_pins interconnect_matrix/M01_AXI]
connect_bd_intf_net [get_bd_intf_pins processing_system7_0/M_AXI_GP0] [get_bd_intf_pins interconnect_matrix/S00_AXI]
connect_bd_intf_net [get_bd_intf_pins processing_system7_0/M_AXI_GP1] [get_bd_intf_pins axi_protocol_convert_0/S_AXI]
connect_bd_intf_net [get_bd_intf_pins audio_video_engine/s_axi_ctrl] [get_bd_intf_pins interconnect_matrix/M06_AXI]
connect_bd_intf_net -intf_net s_axi_lite1_1 [get_bd_intf_pins audio_video_engine/s_axi_lite1] [get_bd_intf_pins interconnect_matrix/M07_AXI]
connect_bd_intf_net -intf_net s_axi_lite1_2 [get_bd_intf_pins clock_generation/s_axi_lite1] [get_bd_intf_pins interconnect_matrix/M00_AXI]
connect_bd_intf_net [get_bd_intf_pins clock_generation/s_axi_lite] [get_bd_intf_pins interconnect_matrix/M05_AXI]
connect_bd_net -net aud_mclk_1 [get_bd_pins clock_generation/clk_out2] [get_bd_pins audio_video_engine/aud_mclk] [get_bd_ports CLK18M_clk]
connect_bd_net [get_bd_pins audio_video_engine/I2SO_D0] [get_bd_ports I2SO_D0]
connect_bd_net [get_bd_pins audio_video_engine/I2S_FSYNC_OUT] [get_bd_ports I2S_FSYNC_OUT]
connect_bd_net [get_bd_pins audio_video_engine/I2S_SCLK] [get_bd_ports I2S_SCLK]
connect_bd_net [get_bd_pins audio_video_engine/control_vblank] [get_bd_ports control_vblank]
connect_bd_net [get_bd_pins audio_video_engine/dout] [get_bd_pins processing_system7_0/IRQ_F2P]
connect_bd_net [get_bd_pins audio_video_engine/hdmi_clk] [get_bd_ports hdmi_clk]
connect_bd_net [get_bd_pins audio_video_engine/hdmi_data] [get_bd_ports hdmi_data]
connect_bd_net [get_bd_pins audio_video_engine/hdmi_de] [get_bd_ports hdmi_de]
connect_bd_net [get_bd_pins audio_video_engine/hdmi_hs] [get_bd_ports hdmi_hs]
connect_bd_net [get_bd_pins audio_video_engine/hdmi_vs] [get_bd_ports hdmi_vs]
connect_bd_net [get_bd_pins clock_generation/AXI_clk] \
  [get_bd_ports AXI1_clk] [get_bd_pins proc_sys_reset_0/slowest_sync_clk] [get_bd_pins axi_register_slice_1/aclk] \
  [get_bd_pins axi_dwidth_converter_0/s_axi_aclk] [get_bd_pins axi_register_slice_0/aclk] \
  [get_bd_pins processing_system7_0/S_AXI_ACP_ACLK] [get_bd_pins axi_protocol_convert_0/aclk] \
  [get_bd_pins processing_system7_0/M_AXI_GP1_ACLK]
connect_bd_net [get_bd_pins clock_generation/BCLK_clk] [get_bd_ports BCLK_clk]
connect_bd_net [get_bd_pins clock_generation/CLK90_clk] [get_bd_ports CLK90_clk]
connect_bd_net [get_bd_pins clock_generation/CPUCLK_clk] [get_bd_ports CPUCLK_clk]
connect_bd_net [get_bd_pins clock_generation/PCLK_clk] [get_bd_ports PCLK_clk]
connect_bd_net [get_bd_pins clock_generation/PCLK_reg] [get_bd_ports PCLK_reg]
connect_bd_net [get_bd_pins clock_generation/nCLKEN_clk] [get_bd_ports nCLKEN_clk]
connect_bd_net [get_bd_pins clock_generation/nCLKEN_reg] [get_bd_ports nCLKEN_reg]
connect_bd_net [get_bd_ports hdmi_intn] [get_bd_pins audio_video_engine/hdmi_intn]
connect_bd_net [get_bd_pins interconnect_matrix/interconnect_aresetn] [get_bd_ports aresetn]
connect_bd_net [get_bd_pins interconnect_matrix/peripheral_aresetn] \
  [get_bd_pins audio_video_engine/s_axi_ctrl_aresetn] [get_bd_pins clock_generation/s_axi_aresetn]
connect_bd_net [get_bd_pins proc_sys_reset_0/peripheral_aresetn] \
  [get_bd_ports aresetn1] [get_bd_pins axi_register_slice_1/aresetn] [get_bd_pins axi_dwidth_converter_0/s_axi_aresetn] \
  [get_bd_pins axi_register_slice_0/aresetn] [get_bd_pins axi_protocol_convert_0/aresetn]
connect_bd_net [get_bd_pins proc_sys_reset_0/peripheral_reset] [get_bd_ports peripheral_reset]
connect_bd_net [get_bd_pins processing_system7_0/FCLK_CLK0] \
  [get_bd_pins processing_system7_0/S_AXI_HP1_ACLK] [get_bd_pins audio_video_engine/M00_ACLK] \
  [get_bd_pins clock_generation/clk_in1]
connect_bd_net [get_bd_pins processing_system7_0/FCLK_CLK1] \
  [get_bd_pins processing_system7_0/M_AXI_GP0_ACLK] [get_bd_pins audio_video_engine/s_axi_ctrl_aclk] \
  [get_bd_pins clock_generation/s_axi_aclk] [get_bd_ports AXI_clk] [get_bd_pins interconnect_matrix/S00_ACLK]
connect_bd_net [get_bd_pins processing_system7_0/FCLK_CLK2] \
  [get_bd_pins processing_system7_0/S_AXI_HP0_ACLK] [get_bd_pins audio_video_engine/s_axis_aud_aclk]
connect_bd_net [get_bd_pins processing_system7_0/FCLK_RESET0_N] \
  [get_bd_pins audio_video_engine/ext_reset_in] [get_bd_pins interconnect_matrix/ext_reset_in] \
  [get_bd_pins proc_sys_reset_0/ext_reset_in]
connect_bd_net -net vid_clk_1 [get_bd_pins clock_generation/clk_out1] [get_bd_pins audio_video_engine/vid_clk]

# ---- address map ----
assign_bd_address -offset 0x00000000 -range 1G -target_address_space [get_bd_addr_spaces audio_video_engine/audio_formatter_0/m_axi_mm2s] [get_bd_addr_segs processing_system7_0/S_AXI_HP1/HP1_DDR_LOWOCM]
assign_bd_address -offset 0x00000000 -range 1G -target_address_space [get_bd_addr_spaces audio_video_engine/video/axi_vdma_0/Data_MM2S] [get_bd_addr_segs processing_system7_0/S_AXI_HP0/HP0_DDR_LOWOCM]
assign_bd_address -offset 0x7FC00000 -range 64K -target_address_space [get_bd_addr_spaces processing_system7_0/Data] [get_bd_addr_segs audio_video_engine/audio_formatter_0/s_axi_lite/reg0]
assign_bd_address -offset 0x7FC10000 -range 64K -target_address_space [get_bd_addr_spaces processing_system7_0/Data] [get_bd_addr_segs audio_video_engine/i2s_transmitter_0/s_axi_ctrl/Reg]
assign_bd_address -offset 0x7FC20000 -range 64K -target_address_space [get_bd_addr_spaces processing_system7_0/Data] [get_bd_addr_segs audio_video_engine/video/video_formatter_0/S_AXI/reg0]
assign_bd_address -offset 0x7FC30000 -range 64K -target_address_space [get_bd_addr_spaces processing_system7_0/Data] [get_bd_addr_segs clock_generation/clk_wiz_0/s_axi_lite/Reg]
assign_bd_address -offset 0x7FC50000 -range 64K -target_address_space [get_bd_addr_spaces processing_system7_0/Data] [get_bd_addr_segs clock_generation/clk_wiz_2/s_axi_lite/Reg]
assign_bd_address -offset 0x7FC60000 -range 64K -target_address_space [get_bd_addr_spaces processing_system7_0/Data] [get_bd_addr_segs interconnect_matrix/xadc_wiz_0/s_axi_lite/Reg]
assign_bd_address -offset 0x7FC70000 -range 64K -target_address_space [get_bd_addr_spaces processing_system7_0/Data] [get_bd_addr_segs M_AXI/Reg]
assign_bd_address -offset 0x7FC80000 -range 64K -target_address_space [get_bd_addr_spaces processing_system7_0/Data] [get_bd_addr_segs audio_video_engine/video/axi_vdma_0/S_AXI_LITE/Reg]
assign_bd_address -offset 0x80000000 -range 512M -target_address_space [get_bd_addr_spaces processing_system7_0/Data] [get_bd_addr_segs M_AXI1/Reg]
assign_bd_address -offset 0x20000000 -range 512M -target_address_space [get_bd_addr_spaces S_AXI] [get_bd_addr_segs processing_system7_0/S_AXI_ACP/ACP_DDR_LOWOCM]
assign_bd_address -offset 0x40000000 -range 1G -target_address_space [get_bd_addr_spaces S_AXI] [get_bd_addr_segs processing_system7_0/S_AXI_ACP/ACP_M_AXI_GP0]
assign_bd_address -offset 0x80000000 -range 1G -target_address_space [get_bd_addr_spaces S_AXI] [get_bd_addr_segs processing_system7_0/S_AXI_ACP/ACP_M_AXI_GP1]
assign_bd_address -offset 0xE0000000 -range 4M -target_address_space [get_bd_addr_spaces S_AXI] [get_bd_addr_segs processing_system7_0/S_AXI_ACP/ACP_IOP]

validate_bd_design
save_bd_design
